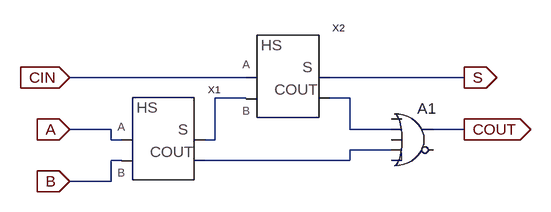
[diagram p0: schematic fullsum.asc]
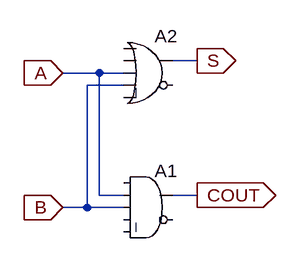
[diagram p1: sub-circuit halfsum.asc]
fullsum.asc, the LTspice schematic file:
Version 4
SHEET 1 880 680
WIRE 400 64 128 64
WIRE 736 64 528 64
WIRE 400 96 352 96
WIRE 560 96 528 96
WIRE 192 144 128 144
WIRE 560 144 560 96
WIRE 624 144 560 144
WIRE 736 144 688 144
WIRE 192 160 192 144
WIRE 208 160 192 160
WIRE 352 160 352 96
WIRE 352 160 336 160
WIRE 624 176 560 176
WIRE 208 192 192 192
WIRE 560 192 560 176
WIRE 560 192 336 192
WIRE 192 224 192 192
WIRE 192 224 128 224
FLAG 128 144 A
IOPIN 128 144 In
FLAG 128 224 B
IOPIN 128 224 In
FLAG 128 64 CIN
IOPIN 128 64 In
FLAG 736 144 COUT
IOPIN 736 144 Out
FLAG 736 64 S
IOPIN 736 64 Out
SYMBOL halfsum 240 176 R0
SYMATTR InstName X1
SYMBOL halfsum 432 80 R0
SYMATTR InstName X2
SYMBOL Digital\\or 656 96 R0
SYMATTR InstName A1

halfsum.asc, the sub-circuit schematic file:
Version 4
SHEET 1 880 680
WIRE 272 -48 240 -48
WIRE 144 -32 96 -32
WIRE 176 -32 144 -32
WIRE 176 -16 128 -16
WIRE 144 128 144 -32
WIRE 176 128 144 128
WIRE 272 128 240 128
WIRE 128 144 128 -16
WIRE 128 144 96 144
WIRE 176 144 128 144
FLAG 96 -32 A
IOPIN 96 -32 In
FLAG 96 144 B
IOPIN 96 144 In
FLAG 272 -48 S
IOPIN 272 -48 Out
FLAG 272 128 COUT
IOPIN 272 128 Out
SYMBOL Digital\\and 208 80 R0
SYMATTR InstName A1
SYMBOL Digital\\or 208 -96 R0
SYMATTR InstName A2

The netlist it stands for:
* fullsum.asc
XX1 A B N001 N003 halfsum
XX2 CIN N001 S N002 halfsum
A1 0 N002 0 N003 0 0 COUT 0 OR

* block symbol definitions
.subckt halfsum A B S COUT
A1 0 A B 0 0 0 COUT 0 AND
A2 0 0 A B 0 0 S 0 OR
.ends halfsum

.backanno
.end